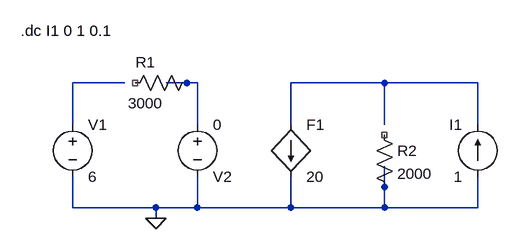
[diagram p0: schematic Ex_04_78.asc]
Ex_04_78.asc, the LTspice schematic file:
Version 4.1
SHEET 1 880 680
WIRE 80 80 0 80
WIRE 192 80 144 80
WIRE 480 80 336 80
WIRE 624 80 480 80
WIRE 0 144 0 80
WIRE 192 144 192 80
WIRE 336 144 336 80
WIRE 480 144 480 80
WIRE 624 144 624 80
WIRE 0 272 0 224
WIRE 128 272 0 272
WIRE 192 272 192 224
WIRE 192 272 128 272
WIRE 336 272 336 224
WIRE 336 272 192 272
WIRE 480 272 480 208
WIRE 480 272 336 272
WIRE 624 272 624 224
WIRE 624 272 480 272
WIRE 128 288 128 272
FLAG 128 288 0
SYMBOL voltage 0 128 R0
WINDOW 123 0 0 Left 0
WINDOW 39 0 0 Left 0
SYMATTR InstName V1
SYMATTR Value 6
SYMBOL res 80 96 R270
WINDOW 0 32 32 VTop 2
WINDOW 3 0 32 VBottom 2
SYMATTR InstName R1
SYMATTR Value 3000
SYMBOL voltage 192 128 R0
WINDOW 0 24 96 Left 2
WINDOW 3 24 16 Left 2
WINDOW 123 0 0 Left 0
WINDOW 39 0 0 Left 0
SYMATTR InstName V2
SYMATTR Value 0
SYMBOL f 336 144 R0
SYMATTR InstName F1
SYMATTR Value 20
SYMATTR SpiceModel V1
SYMBOL res 464 144 R0
SYMATTR InstName R2
SYMATTR Value 2000
SYMBOL current 624 224 R180
WINDOW 0 24 80 Left 2
WINDOW 3 24 0 Left 2
WINDOW 123 0 0 Left 0
WINDOW 39 0 0 Left 0
SYMATTR InstName I1
SYMATTR Value 1
TEXT -80 0 Left 2 !.dc I1 0 1 0.1

The netlist it stands for:
* Ex_04_78.asc
V1 N001 0 6
R1 NC_01 N002 3000
V2 N002 0 0
F1 N003 0 V1 20
R2 NC_02 0 2000
I1 0 N003 1
.dc I1 0 1 0.1
.backanno
.end